# Altium schematic sheet 12V_to_5V.SchDoc
size A; SheetNumber: 1; SheetTotal: 4
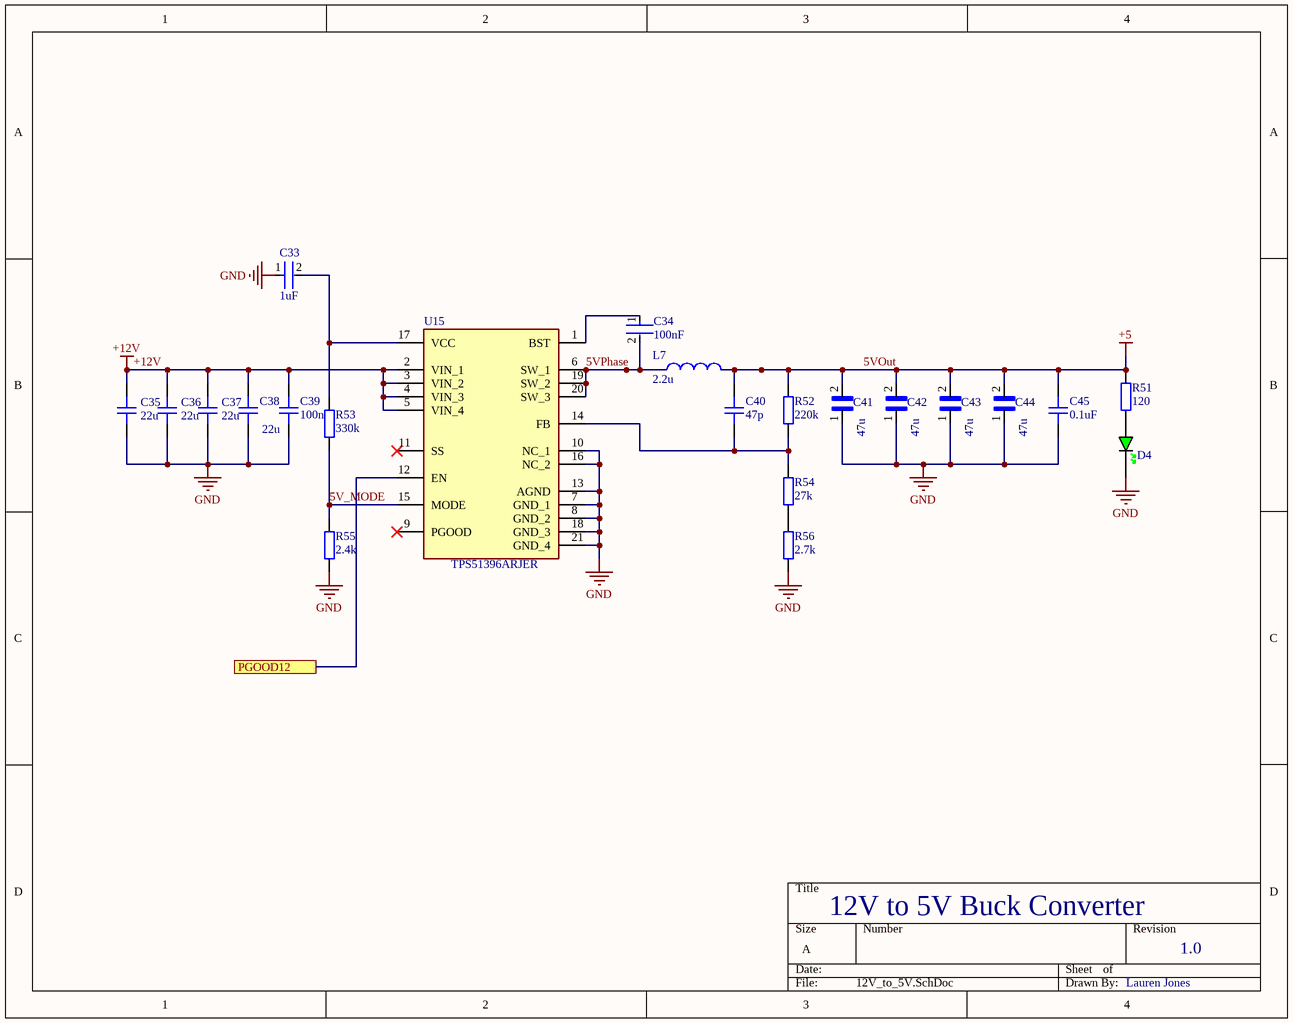
[diagram p0: 12V_to_5V.SchDoc]

## Parts
C33  1uF  [FP-CL283-IPC_C]
C34  100nF  [FP-CC0603-DA-MFG]
C35  22u  [CAP_0805]
C36  22u  [CAP_0805]
C37  22u  [CAP_0805]
C38  22u  [CAP_0805]
C39  100n  [CAP_0603]
C40  47p  [CAP_0402]
C41  47u  [CAP_CGA9N3X7R1C476M230KB]
C42  47u  [CAP_CGA9N3X7R1C476M230KB]
C43  47u  [CAP_CGA9N3X7R1C476M230KB]
C44  47u  [CAP_CGA9N3X7R1C476M230KB]
C45  0.1uF  [CAP_1206]
D4  GREEN  [LED_0805_GREEN]  (value not drawn)
L7  2.2u  [IND_SPM10040T-2R2M-HZ]
R51  120  [RES_0805]
R52  220k  [RES_0603]
R53  330k  [RES_0603]
R54  27k  [RES_0603]
R55  2.4k  [RES_0603]
R56  2.7k  [RES_0603]
U15  TPS51396ARJER  [TPS51396ARJER]

## Ports
PGOOD12

## Nets
5VOut: C40.2 C41.2 C42.2 C43.2 C44.2 C45.2 L7.2 R51.2 R52.2  [also labelled +5]
+12V: C35.2 C36.2 C37.2 C38.2 C39.2 U15.2(VIN_1) U15.3(VIN_2) U15.4(VIN_3) U15.5(VIN_4)
GND: C33.1 C35.1 C36.1 C37.1 C38.1 C39.1 C41.1 C42.1 C43.1 C44.1 C45.1 D4.K R55.1 R56.1 U15.7(GND_1) U15.8(GND_2) U15.10(NC_1) U15.13(AGND) U15.16(NC_2) U15.18(GND_3) U15.21(GND_4)
5V_MODE: R53.1 R55.2 U15.15(MODE)
5VPhase: C34.2 L7.1 U15.6(SW_1) U15.19(SW_2) U15.20(SW_3)
PGOOD12: U15.12(EN) ; port PGOOD12
NetC33_2: C33.2 R53.2 U15.17(VCC)
NetC34_1: C34.1 U15.1(BST)
NetC40_1: C40.1 R52.1 R54.2 U15.14(FB)
NetD4_A: D4.A R51.1
NetR54_1: R54.1 R56.2

Not connected (* = marked no-connect by the designer): U15 9(PGOOD)* 11(SS)*

## Notes on the sheet
- 12V to 5V Buck Converter
- 1.0
- Lauren Jones

## Library data of the parts
C33 = CMP-13271-003018-1: Cap Ceramic 4.7uF 6.3V X5R ±20% SMD 0402 +85°C Paper T/R; Lead Free: Lead Free; Voltage Rating: 6.3V; Case Code (Metric): 1005; Package Quantity: 1; Capacitance: 4.7uF; Length: 0.039inch; Mount: Surface Mount; Radiation Hardening: No; Packaging: Tape and Reel; Tolerance: 20%; Max Operating Temperature: 85°C; Width: 0.02inch; Case Code (Imperial): 0402; Thickness: 0.022inch; Min Operating Temperature: -55°C; Dielectric: X5R; Case/Package: 0402; Depth: 0.5mm
C34 = CMP-2100-03601-2: CAP CER 0.1UF 50V X7R 0603 / CC0603KRX7R9BB104; Manufacturer: YAGEO; Material: Ceramic; Temperature Coefficient: 15%; Tolerance: 0.1; Height: 0.9mm; Voltage: 50 V; ComponentLink2Description: Datasheet; Device Class L2: Capacitors; Temperature Range High: +125°C; Category: Cap; Capacitance: 100 nF; Footprint Url: http://www.yageo.com/exep/pages/download/literatures/UPY-C_GEN_24.pdf; ComponentLink2URL: http://www.yageo.com/documents/recent/UPY-GPHC_X7R_6.3V-to-50V_18.pdf; Package: CC0603-DA; Temperature: -55°C to +125°C; Voltage Rating: 50 V; Temperature Characteristic: X7R; Device Class L1: Passive Components; Temperature Range Low: -55°C; Manufacturer Part Number: CC0603KRX7R9BB104; RoHS: TRUE; Automotive: No; Value: 100 nF; Device Class L3: Ceramic Capacitors; Octopart: https://octopart.com/cc0603krx7r9bb104-yageo-42244635; Mouser Description: Multilayer Ceramic Capacitor, CC Series, 0.1 - F, - 10%, X7R, 50 V, 0603 [1608 Metric]; Lead Free: Yes; Digikey Description: CAP CER 0.1UF 50V X7R 0603
C35-C38 = CAP_0805: Capacitor SMD 0805; Manufacturer: *; Manufacturer Part Number: *; Distributor Link: *; LCSC: *; Rating: *; Dielectric: *
C39 = CAP_0603: Capacitor SMD 0603; Manufacturer: *; Manufacturer Part Number: *; Distributor Link: *; LCSC: *; Rating: *; Dielectric: *
C40 = CAP_0402: Capacitor SMD 0402; Manufacturer: *; Manufacturer Part Number: *; Distributor Link: *; LCSC: *; Rating: *; Dielectric: *
C41-C44 = CGA9N3X7R1C476M230KB: 47µF ±20% 16V Ceramic Capacitor X7R 2220 (5750 Metric); MF: TDK; SnapEDA_Link: https://www.snapeda.com/parts/CGA9N3X7R1C476M230KB/TDK/view-part/1756766/?ref=snap; MP: CGA9N3X7R1C476M230KB; Digi-Key_Part_Number: 445-7935-1-ND; Value: *; Mouser-Purchase-URL: https://snapeda.com/shop?store=Mouser&id=1756766; Package: 2220 TDK; DigiKey-Purchase-URL: https://snapeda.com/shop?store=DigiKey&id=1756766
C45 = CAP_1206: Capacitor SMD 1206; Manufacturer: *; Manufacturer Part Number: *; Distributor Link: *; LCSC: *; Rating: *; Dielectric: *
D4 = LED_0805_GREEN: KT-0805G; Manufacturer: *; Manufacturer Part Number: *; Distributor Link: *; LCSC: *
L7 = SPM10040T-2R2M-HZ: Inductor Power Shielded Wirewound 2.2uH 20% 100KHz Metal 16.7A 0.00748Ohm DCR Automotive T/R; MF: TDK; DigiKey_Part_Number: 445-180236-2-ND; Purchase-URL: https://pricing.snapeda.com/search?q=SPM10040T-2R2M-HZ&ref=eda; Package: NON STANDARD-2 TDK; Check_prices: https://www.snapeda.com/parts/SPM10040T-2R2M-HZ/TDK/view-part/?ref=eda; Value: *; SnapEDA_Link: https://www.snapeda.com/parts/SPM10040T-2R2M-HZ/TDK/view-part/?ref=snap; MP: SPM10040T-2R2M-HZ
R51 = RES_0805: Resistor SMD 0805; Manufacturer: *; Manufacturer Part Number: *; Distributor Link: *; LCSC: *
R52-R56 = RES_0603: Resistor SMD 0603; Manufacturer: *; Manufacturer Part Number: *; Distributor Link: *; LCSC: *
U15 = TPS51396ARJER: Buck Switching Regulator IC Positive Adjustable 0.6V 1 Output 8A 20-VFQFN Exposed Pad; Manufacturer_Name: Texas Instruments; Geometry.Height: 1mm; Mouser Part Number: 595-TPS51396ARJER; Mouser Price/Stock: https://www.mouser.co.uk/ProductDetail/Texas-Instruments/TPS51396ARJER?qs=GBLSl2AkirtKr8QWcQ0Vig%3D%3D; Manufacturer_Part_Number: TPS51396ARJER; Datasheet Link: https://www.ti.com/lit/ds/symlink/tps51396a.pdf?HQS=dis-mous-null-mousermode-dsf-pf-null-wwe&ts=1662566370253&ref_url=https%253A%252F%252Fwww.mouser.in%252F; LCSC Part #: C3032872